# Altium schematic sheet Sheet1.SchDoc: Power Distribution Board
size 431 x 279 mm; ENG_APP_DATE: --/--/--; DSN_APP_DATE: --/--/--; CHK_APP_DATE: --/--/--; Date: 2023-01-01; Author: Vinai Birbal; DocumentNumber: 1; Revision: 1; SheetNumber: 1; SheetTotal: 1
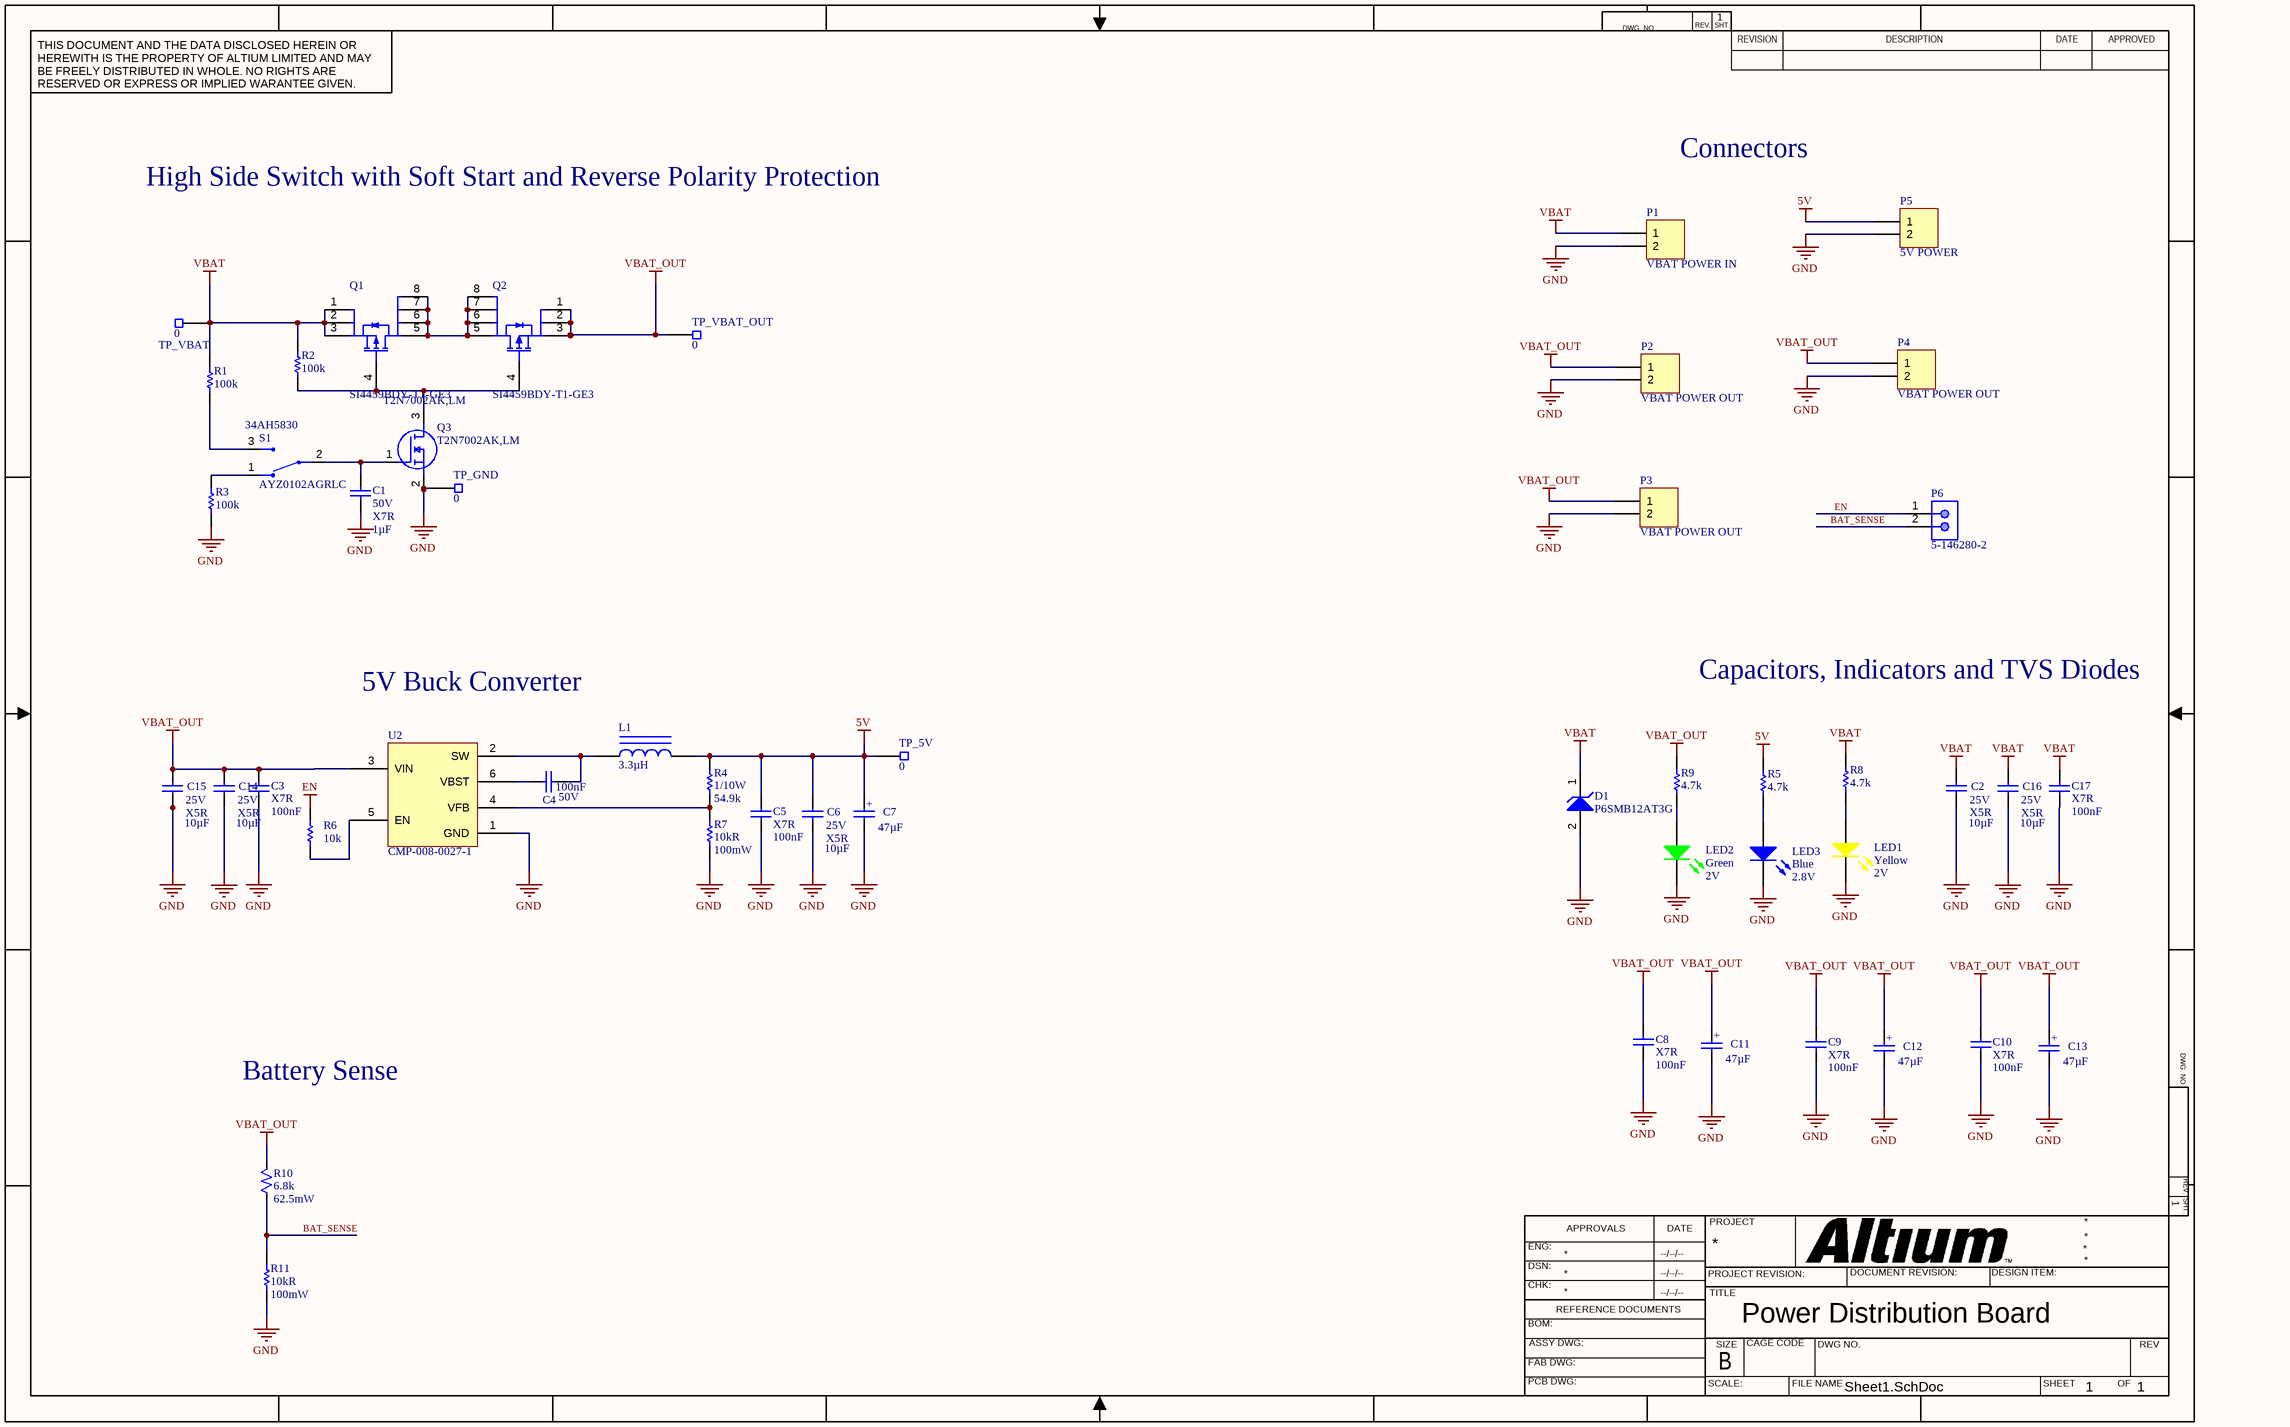
[diagram p0: Sheet1.SchDoc]

## Parts
C1  value 1µF  Voltage: 50V  Temperature Coefficient: X7R  [CAP, 0603]  (hidden comment: CAP CER 1UF 50V 10% X7R 0603)
C2  value 10µF  Voltage: 25V  Temperature Coefficient: X5R  [CAP, 0603]  (hidden comment: CMP-013-0018-1)
C3  value 100nF  Temperature Coefficient: X7R  [FP-GCJ188-0_2-IPC_C]  (hidden comment: CAP_0.1UF_50V_X7R_0603)
C4  value 100nF  Voltage: 50V  [CAP, 0603]  (hidden comment: CMP-013-0022-3)
C5  value 100nF  Temperature Coefficient: X7R  [FP-GCJ188-0_2-IPC_C]  (hidden comment: CAP_0.1UF_50V_X7R_0603)
C6  value 10µF  Voltage: 25V  Temperature Coefficient: X5R  [CAP, 0603]  (hidden comment: CMP-013-0018-1)
C7  value 47µF  [CAP ALUM 6.3MM RADIAL SMD]  (hidden comment: CMP-013-0000-3)
C8  value 100nF  Temperature Coefficient: X7R  [FP-GCJ188-0_2-IPC_C]  (hidden comment: CAP_0.1UF_50V_X7R_0603)
C9  value 100nF  Temperature Coefficient: X7R  [FP-GCJ188-0_2-IPC_C]  (hidden comment: CAP_0.1UF_50V_X7R_0603)
C10  value 100nF  Temperature Coefficient: X7R  [FP-GCJ188-0_2-IPC_C]  (hidden comment: CAP_0.1UF_50V_X7R_0603)
C11  value 47µF  [CAP ALUM 6.3MM RADIAL SMD]  (hidden comment: CMP-013-0000-3)
C12  value 47µF  [CAP ALUM 6.3MM RADIAL SMD]  (hidden comment: CMP-013-0000-3)
C13  value 47µF  [CAP ALUM 6.3MM RADIAL SMD]  (hidden comment: CMP-013-0000-3)
C14  value 10µF  Voltage: 25V  Temperature Coefficient: X5R  [CAP, 0603]  (hidden comment: CMP-013-0018-1)
C15  value 10µF  Voltage: 25V  Temperature Coefficient: X5R  [CAP, 0603]  (hidden comment: CMP-013-0018-1)
C16  value 10µF  Voltage: 25V  Temperature Coefficient: X5R  [CAP, 0603]  (hidden comment: CMP-013-0018-1)
C17  value 100nF  Temperature Coefficient: X7R  [FP-GCJ188-0_2-IPC_C]  (hidden comment: CAP_0.1UF_50V_X7R_0603)
D1  P6SMB12AT3G  [ONSC-SMB-2-403A-03_J_V]
L1  Inductance: 3.3µH  [IND 3.3UH 5.2A 20 MOHM SMD VLP8040]  (hidden comment: CMP-009-0008-2)
LED1  Color: Yellow  Voltage - Forward (Vf) (Typ): 2V  [LED_0603]  (hidden comment: LED YELLOW CLEAR 2.1V 0603)
LED2  Color: Green  Voltage - Forward (Vf) (Typ): 2V  [LED_0603]  (hidden comment: LED GREEN CLEAR 2V 0603)
LED3  Color: Blue  Voltage - Forward (Vf) (Typ): 2.8V  [LED_0603]  (hidden comment: LED BLUE CLEAR 2.8V 0603)
P1  VBAT POWER IN  [B2B-XH]
P2  VBAT POWER OUT  [B2B-XH]
P3  VBAT POWER OUT  [B2B-XH]
P4  VBAT POWER OUT  [B2B-XH]
P5  5V POWER  [B2B-XH]
P6  5-146280-2  [TECO-5-146280-2_V]
Q1  SI4459BDY-T1-GE3  [SI4459BDY-T1-GE3-Footprint-1]
Q2  SI4459BDY-T1-GE3  [SI4459BDY-T1-GE3-Footprint-1]
Q3  T2N7002AK,LM  [TBAT54CLM]
R1  value 100k  [RESC1608X55X25ML10T15]  (hidden comment: Resistor 100k +/-1% 0603 100 mW)
R2  value 100k  [RESC1608X55X25ML10T15]  (hidden comment: Resistor 100k +/-1% 0603 100 mW)
R3  value 100k  [RESC1608X55X25ML10T15]  (hidden comment: Resistor 100k +/-1% 0603 100 mW)
R4  Power (Watts): 1/10W  Resistance (Ohms): 54.9k  [RES, 0603]  (hidden comment: CMP-010-0030-1)
R5  Resistance: 4.7k  [RES, 0603]  (hidden comment: RES 4.7K OHM 1% 1/10W 0603)
R6  Resistance: 10k  [RESC1609X50X30ML8T20]  (hidden comment: RES SMD 10K OHM 1% 1/10W 0603)
R7  Resistance: 10kR  Rated Power Dissipation (P): 100mW  [RESC1609X50X30ML8T20]  (hidden comment: RES SMD 10K OHM 1% 1/10W 0603)
R8  Resistance: 4.7k  [RES, 0603]  (hidden comment: RES 4.7K OHM 1% 1/10W 0603)
R9  Resistance: 4.7k  [RES, 0603]  (hidden comment: RES 4.7K OHM 1% 1/10W 0603)
R10  value 6.8k  Rated Power Dissipation (P): 62.5mW  [RES 0402]  (hidden comment: RES 6.8K OHM 5% 1/16W 0402)
R11  Resistance: 10kR  Rated Power Dissipation (P): 100mW  [RESC1609X50X30ML8T20]  (hidden comment: RES SMD 10K OHM 1% 1/10W 0603)
S1  AYZ0102AGRLC  Supplier Part Number 1: 34AH5830  [SW_AYZ0102AGRLC]
TP_5V  Resistance: 0  [TEST POINT 0603 SMD]  (hidden comment: Test Point 0603 SMD)
TP_GND  Resistance: 0  [TEST POINT 0603 SMD]  (hidden comment: Test Point 0603 SMD)
TP_VBAT  Resistance: 0  [TEST POINT 0603 SMD]  (hidden comment: Test Point 0603 SMD)
TP_VBAT_OUT  Resistance: 0  [TEST POINT 0603 SMD]  (hidden comment: Test Point 0603 SMD)
U2  CMP-008-0027-1  [IC REG BUCK 4.5V TO 17V, 5A]

## Nets
5V: C5.2 C6.1 C7.1 L1.2 P5.1 R4.1 R5.1 TP_5V.1
EN: P6.1 R6.2
GND: C1.2 C2.2 C3.1 C5.1 C6.2 C7.2 C8.1 C9.1 C10.1 C11.2 C12.2 C13.2 C14.2 C15.2 C16.2 C17.1 D1.2(A) LED1.2(K) LED2.2(K) LED3.2(K) P1.2 P2.2 P3.2 P4.2 P5.2 Q3.2(S) R3.1 R7.1 R11.1 TP_GND.1 U2.1(GND)
VBAT: C2.1 C16.1 C17.2 D1.1(K) P1.1 Q1.1(S) Q1.2(S) Q1.3(S) R1.2 R2.2 R8.1
VBAT_OUT: C3.2 C8.2 C9.2 C10.2 C11.1 C12.1 C13.1 C14.1 C15.1 P2.1 P3.1 P4.1 Q2.1(S) Q2.2(S) Q2.3(S) R9.1 R10.2 TP_VBAT_OUT.1 U2.3(VIN)
BAT_SENSE: P6.2 R10.1 R11.2
NetC1_1: C1.1 Q3.1(G) S1.2
NetC4_1: C4.1 U2.6(VBST)
NetC4_2: C4.2 L1.1 U2.2(SW)
NetLED1_1: LED1.1(A) R8.2
NetLED2_1: LED2.1(A) R9.2
NetLED3_1: LED3.1(A) R5.2
NetQ1_4: Q1.4(G) Q2.4(G) Q3.3(D) R2.1
NetQ1_5: Q1.5(D) Q1.6(D) Q1.7(D) Q1.8(D) Q2.5(D) Q2.6(D) Q2.7(D) Q2.8(D)
NetR1_1: R1.1 S1.3
NetR3_2: R3.2 S1.1
NetR4_2: R4.2 R7.2 U2.4(VFB)
NetR6_1: R6.1 U2.5(EN)

Not connected (* = marked no-connect by the designer): TP_VBAT 1

## Notes on the sheet
- Connectors
- High Side Switch with Soft Start and Reverse Polarity Protection
- 5V Buck Converter
- Capacitors, Indicators and TVS Diodes
- Battery Sense
- DWG. NO.
- REV.
- SHT.
- THIS DOCUMENT AND THE DATA DISCLOSED HEREIN OR HEREWITH IS THE PROPERTY OF ALTIUM LIMITED AND MAY BE FREELY DISTRIBUTED IN WHOLE. NO RIGHTS ARE RESERVED OR EXPRESS OR IMPLIED WARANTEE GIVEN.
- REVISION
- DESCRIPTION
- DATE
- APPROVED
- ENG:
- APPROVALS
- PROJECT
- DSN:
- CHK:
- REFERENCE DOCUMENTS
- PROJECT REVISION:
- TITLE
- DOCUMENT REVISION:
- DESIGN ITEM:
- BOM:
- FAB DWG:
- PCB DWG:
- ASSY DWG:
- SCALE:
- SIZE
- B
- CAGE CODE
- FILE NAME
- DWG NO.
- SHEET
- OF
- REV
- (in symbol CMP-013-0000-3) +

## Library data of the parts
C1 = CMP-013-0013-1: 1µF ±10% 50V Ceramic Capacitor X7R 0603 (1608 Metric); Manufacturer Part Number 1: UMK107AB7105KA-T; Manufacturer 1: Taiyo Yuden; ComponentLink1Description: http://www.yuden.co.jp/productdata/catalog/en/mlcc_all_e.pdf; Ratings: -; Part Status: Active; Packaging: Cut Tape (CT); Source: Schematic Diagrams.SchLib; Operating Temperature: -55°C ~ 125°C; Package / Case: 0603 (1608 Metric); Mounting Type: Surface Mount, MLCC; Height - Seated (Max): -; Design Item ID: CAP CER 1UF 50V 10% X7R 0603; Lead Spacing: -; Tolerance: 10%; Lead Style: -; ComponentLink1URL: http://www.yuden.co.jp/productdata/catalog/en/mlcc_all_e.pdf
C2 C6 C14-C16 = CMP-013-0018-1: 10µF ±20% 25V Ceramic Capacitor X5R 0603 (1608 Metric); Manufacturer 1: Murata Electronics North America; Manufacturer Part Number 1: GRM188R61E106MA73D; Packaging: Cut Tape (CT); Part Status: Active; Operating Temperature: -55°C ~ 85°C; Ratings: -; Mounting Type: Surface Mount, MLCC; Package / Case: 0603 (1608 Metric); Size / Dimension: 0.063" L x 0.031" W (1.60mm x 0.80mm); Height - Seated (Max): -; Thickness (Max): 0.031" (0.80mm); Lead Spacing: -; Lead Style: -; ComponentLink1URL: http://www.murata.com/~/media/webrenewal/support/library/catalog/products/capacitor/mlcc/c02e.ashx; ComponentLink1Description: http://www.murata.com/~/media/webrenewal/support/library/catalog/products/capacitor/mlcc/c02e.ashx; Tolerance: 20%; Source: Schematic Diagrams.SchLib; Design Item ID: CAP CER 10uF 25V 20% X5R 0603
C3 C5 C8-C10 C17 = CMP-001-00108-2: CAP CER 0.1UF 50V X7R 0603; Manufacturer 1: Murata Electronics; Manufacturer Part Number 1: GCJ188R71H104KA12D; Tolerance: 10%; Capacitor Type: Ceramic; Pins: 2; Case/Package: 0603; Voltage Rating: 50V; Mounting Technology: Surface Mount; RoHS Compliant: Yes; Max Operating Temperature: 125°C; Min Operating Temperature: -55°C
C4 = CMP-013-0022-3: 0.10µF ±10% 50V Ceramic Capacitor X7R 0603 (1608 Metric); Manufacturer 1: AVX Corporation; Manufacturer Part Number 1: 06035C104KAT2A; Supplier 1: Digi-key; Supplier Part Number 1: 478-5052-1-ND; Packaging: Cut Tape (CT); Part Status: Active; Operating Temperature: -55°C ~ 125°C; Ratings: -; Mounting Type: Surface Mount, MLCC; Package / Case: 0603 (1608 Metric); Size / Dimension: 0.063" L x 0.032" W (1.60mm x 0.81mm); Height - Seated (Max): -; Thickness (Max): 0.035" (0.90mm); Lead Spacing: -; Lead Style: -; ComponentLink1URL: http://datasheets.avx.com/X7RDielectric.pdf; ComponentLink1Description: http://datasheets.avx.com/X7RDielectric.pdf; Tolerance: 10%; Design Item ID: CAP CER 0.1UF 50V 10% X7R 0603; Source: Schematic Diagrams.SchLib
C7 C11-C13 = CMP-013-0000-3: 47µF 35V Aluminum Electrolytic Capacitors Radial, Can - SMD 1000 Hrs @ 85°C; Manufacturer Part Number 1: EEE-1VA470WP; Manufacturer 1: Panasonic; Tolerance: 20%; Ripple Current: 70mA; Life (Hours): 1000Hour; Supplier 1: Digi-Key; Stock 1: 2820; Pricing 1: 1=0.38, 10=0.263, 100=0.1579, 500=0.11846 (USD); Mount: Surface Mount,PCB; Case/Package: Radial; Contact Plating: Tin; Min Operating Temperature: -40°C; Max Operating Temperature: 85°C; Voltage Rating (DC): 35V; Voltage Rating: 35V; Packaging: Tape and Reel; Package Quantity: 1; Ripple Current (AC): 70mA; Termination: SMD/SMT; Diameter: 6.3mm; Length: 5.5mm; Height: 5.4mm; Height - Seated (Max): 0.213inch; Radiation Hardening: No; REACH SVHC: Unknown; Lead Free: Lead Free; ComponentLink1URL: https://datasheet.ciiva.com/2983/aba0000ce2-2983926.pdf; ComponentLink1Description: https://datasheet.ciiva.com/2983/aba0000ce2-2983926.pdf; ComponentLink2URL: https://datasheet.ciiva.com/2983/aba0000ce2-2983927.pdf; ComponentLink2Description: https://datasheet.ciiva.com/2983/aba0000ce2-2983927.pdf; ComponentLink3URL: https://datasheet.ciiva.com/14598/70255710-14598937.pdf; ComponentLink3Description: https://datasheet.ciiva.com/14598/70255710-14598937.pdf; ComponentLink4URL: https://datasheet.ciiva.com/15165/getdatasheetpartid-86239-15165868.pdf; ComponentLink4Description: https://datasheet.ciiva.com/15165/getdatasheetpartid-86239-15165868.pdf; ComponentLink5URL: https://datasheet.ciiva.com/16507/aba0000ce2-16507965.pdf; ComponentLink5Description: https://datasheet.ciiva.com/16507/aba0000ce2-16507965.pdf; ComponentLink6URL: https://datasheet.ciiva.com/30206/11aba0000ce2-30206253.pdf; ComponentLink6Description: https://datasheet.ciiva.com/30206/11aba0000ce2-30206253.pdf; Supplier Part Number 1: PCE3961DKR-ND; Source: Schematic Diagrams.SchLib; Design Item ID: CAP ALUM 47UF 20% 35V SMD
D1 = CMP-1061-00398-1: 600 W Peak Power Zener Transient Voltage Suppressor, Unidirectional, 2-Pin SMB, Pb-Free, Tape and Reel; Manufacturer: On Semiconductor; V(BR) Typ (V): 12; PPK Max (W): 600; IR Max (uA): 5; PackageVersion: Rev. J, 07/2012; PackageReference: SMB-2-403A-03_J; ComponentLink3Description: Package Specification; ComponentLink2Description: Datasheet; Direction: Unidirectional; ComponentLink1Description: Manufacturer URL; ComponentLink2URL: http://www.onsemi.com/pub_link/Collateral/P6SMB6.8AT3-D.PDF; DatasheetVersion: Rev. J; Mounting Technology: Surface Mount; PartNumber: P6SMB12AT3G; ComponentLink3URL: http://www.onsemi.com/pub_link/Collateral/P6SMB6.8AT3-D.PDF; RoHS: Pb-Free; Packing: Tape and Reel; ComponentLink1URL: http://www.onsemi.com/; PackageDescription: 2-Pin Small Molded Package, J-Bend Lead, Body 4.33 x 3.625 mm
L1 = CMP-009-0008-2: 3.3µH Shielded Wirewound Inductor 5.2A 20 mOhm Max Nonstandard; Manufacturer Part Number 1: VLS201612CX-3R3M; Manufacturer 1: TDK Corporation; Material - Core: Ferrite; Tolerance: 20%; Current Rating: 1.37A; Current - Saturation: 1.04A; DC Resistance (DCR): 170 mOhm Max; Frequency - Test: 1MHz; Inductance Tolerance: 30%; Test Frequency: 100kHz; RoHS: RoHS Compliant; Packaging: Cut Tape (CT); Shielding: Shielded; Q @ Freq: -; Frequency - Self Resonant: -; Operating Temperature: -40°C ~ 105°C; Mounting Type: Surface Mount; Package / Case: Nonstandard; Size / Dimension: 0.079" L x 0.063" W (2.00mm x 1.60mm); Height - Seated (Max): 0.047" (1.20mm); Supplier Device Package: 2016; ComponentLink1URL: http://product.tdk.com/en/catalog/datasheets/inductor_commercial_power_vls-cx_en.pdf; ComponentLink1Description: http://product.tdk.com/en/catalog/datasheets/inductor_commercial_power_vls-cx_en.pdf; Supplier 1: Digi-Key; Stock 1: 8114; Pricing 1: 1 = 0.60000, 10 = 0.52700, 100 = 0.37660, 500 = 0.31636 (USD); Mount: Surface Mount; Case/Package: Nonstandard; Core Material: Ferrite; Min Operating Temperature: -40°C; Max Operating Temperature: 105°C; Package Quantity: 1; Saturation Current: 5.2A; Max DC Current: 5.2A; Termination: SMD/SMT; Composition: Wirewound; RMS Current (Irms): 5.2A; Military Standard: Not; Length: 0.315inch; Height: 4mm; Width: 8mm; Depth: 8.7mm; REACH SVHC: No SVHC; Lead Free: Lead Free; ComponentLink2URL: http://www.mouser.com/ds/2/400/nductor_commercial_power_vlp8040_en-952627.pdf; ComponentLink2Description: http://www.mouser.com/ds/2/400/nductor_commercial_power_vlp8040_en-952627.pdf; Supplier Part Number 1: 445-172964-1-ND; Source: Schematic Diagrams.SchLib; Design Item ID: IND 3.3uH 5.2A 20MOHM SMD
LED1 = CMP-011-0011-2: Yellow 590nm LED Indication - Discrete 2V 0603 (1608 Metric); Manufacturer Part Number: 150060YS75000; Manufacturer: Wurth Electronics Inc.; Millicandela Rating: 120mcd; Wavelength - Peak: 595nm; Lens Style/Size: Rectangle with Flat Top, 1.10mm x 0.70mm; Lens Color: Colorless; Viewing Angle: 140°; Current - Test: 20mA; ComponentLink1URL: http://katalog.we-online.de/led/datasheet/150060YS75000.pdf; Part Status: Active; Height (Max): 0.80mm; Source: Schematic Diagrams.SchLib; Mounting Type: Surface Mount; Supplier Device Package: 0603; Pricing 1: 1=0.21, 100=0.1617, 500=0.13964 (CAD); Packaging: Cut Tape (CT); Features: -; Wavelength - Dominant: 590nm; Design Item ID: LED YELLOW CLEAR 2.1V 0603; Case/Package: 0603 (1608 Metric); Lens Transparency: Clear; RoHS: RoHS Compliant; ComponentLink1Description: http://katalog.we-online.de/led/datasheet/150060YS75000.pdf; Stock 1: 10523; Size / Dimension: 1.60mm L x 0.80mm W
LED2 = CMP-011-0009-2: Green 572nm LED Indication - Discrete 2V 0603 (1608 Metric); Manufacturer: Wurth Electronics Inc.; Manufacturer Part Number: 150060VS75000; Lens Color: Colorless; Wavelength - Dominant: 570nm; Lens Style/Size: Rectangle with Flat Top, 1.10mm x 0.70mm; Current - Test: 20mA; Viewing Angle: 140°; Millicandela Rating: 40mcd; Features: -; Stock 1: 9408; Lens Transparency: Clear; Size / Dimension: 1.60mm L x 0.80mm W; Pricing 1: 1=0.21, 100=0.1617, 500=0.13964 (CAD); Mounting Type: Surface Mount; Design Item ID: LED GREEN CLEAR 2V 0603; ComponentLink1URL: http://katalog.we-online.de/led/datasheet/150060VS75000.pdf; Height (Max): 0.80mm; Source: Schematic Diagrams.SchLib; RoHS: RoHS Compliant; Case/Package: 0603 (1608 Metric); Packaging: Cut Tape (CT); Supplier Device Package: 0603; ComponentLink1Description: http://katalog.we-online.de/led/datasheet/150060VS75000.pdf; Part Status: Active; Wavelength - Peak: 572nm
LED3 = CMP-011-0010-2: Blue 470nm LED Indication - Discrete 2.8V 0603 (1608 Metric); Manufacturer 1: Lite-On Inc.; Manufacturer Part Number 1: LTST-C193TBKT-5A; Viewing Angle: 130°; Lens Color: Colorless; Lens Style/Size: Rectangle with Flat Top, 1.15mm x 0.80mm; Millicandela Rating: 15mcd; Wavelength - Peak: 468nm; Current - Test: 5mA; Design Item ID: LED BLUE CLEAR 2.8V 0603; ComponentLink1URL: http://optoelectronics.liteon.com/upload/download/DS22-2004-060/P_100_LTST-C193TBKT-5A.pdf; Lens Transparency: Clear; Wavelength - Dominant: 470nm; Source: Schematic Diagrams.SchLib; Supplier Device Package: Chip LED; Case/Package: 0603 (1608 Metric); Height (Max): 0.45mm; Packaging: Cut Tape (CT); Size / Dimension: 1.60mm L x 0.80mm W; Part Status: Active; Mounting Type: Surface Mount; ComponentLink1Description: http://optoelectronics.liteon.com/upload/download/DS22-2004-060/P_100_LTST-C193TBKT-5A.pdf
P1-P5 = 1x2 Header: 1x2 Pin Header
  P1: ComponentLink1Description: New link; ComponentLink1URL: *; ComponentLink2Description: New link 1; ComponentLink2URL: *
P6 = CMP-2000-07492-1: Male Header, Pitch 2.54 mm, 1 x 2 Position, Height 8.21 mm, Tail Length 3.05 mm, -65 to 105 degC, RoHS, Bulk; Manufacturer: TE Connectivity; Mating Connector Lock: No(Without); Number of Positions: 2; Pitch: 2.54mm; PCB Mounting Orientation: Vertical; Keyed: No; Case\/Package: 100; Mating Post Length: 0.23inch; High Temperature Housing: Yes; Max Current Rating: 5A; PCB Thickness: 0.063inch; PCB Mount Retention: Without; Approvals: CSA; Current Rating: 3A; Radiation Hardening: No; Length: 4.67mm; Contact Mating Length: 0.23inch; Connector Type: Header; Number of Rows: 1; Termination Post Length: 0.12inch; Board Standoff: No(Without); Max Operating Temperature: 105degC; Contact Shape: Square; Selectively Loaded: No(Without); Gasket: No(Without); Number of Contacts: 2; Contact Gender: Male; Mating Alignment: No(Without); Manufacturer URL: http://www.te.com/; Datasheet URL: http://www.te.com/commerce/DocumentDelivery/DDEController?Action=showdoc&DocId=Customer+Drawing%7F146280%7FH1%7Fpdf%7FEnglish%7FENG_CD_146280_H1.pdf%7F5-146280-2; Mount: ThroughHole; Orientation: Straight; Packaging: Carton; Package Reference: 5-146280-2; Package Quantity: 500; Stabilizers: No(Without); Row Spacing: 2.54mm; Contact Material: CopperAlloy; Panel Mount Retention: No(Without); Datasheet Version: Rev. H1, 08/2016; Housing Colour: Black; Colour: Black; Package Description: Male Header, Pitch 2.54 mm, 1 x 2 Position, Height 8.21 mm, Tail Length 3.05 mm; Contact Plating: Matte; Housing Material: Polymer; Contact Protection: No(Without); Min Operating Temperature: -65degC; Mounting Technology: ThroughHole; Flammability Rating: UL94V-0; RoHSCompliant: true; Termination: ThroughHole; Depth: 2.34mm; High Speed Serial Data Connector: No
Q1 Q2 = CMP-031-00041-1: Small Signal Field-Effect Transistor; RoHS Compliant: Yes
Q3 = T2N7002AK,LM: MOSFET (N-Channel); Manufacturer_Name: Toshiba; Datasheet Link: http://toshiba.semicon-storage.com/info/docget.jsp?did=29712&prodName=T2N7002AK; Height: 1.1mm; Manufacturer_Part_Number: T2N7002AK,LM; Mouser Part Number: 757-T2N7002AKLM; Mouser Price/Stock: https://www.mouser.co.uk/ProductDetail/Toshiba/T2N7002AKLM?qs=pzVvXTvk9PzfX4hYglwZ9Q%3D%3D; Arrow Part Number: T2N7002AK,LM; Arrow Price/Stock: https://www.arrow.com/en/products/t2n7002aklm/toshiba?region=nac; Supplier 1: Avnet; Supplier Part Number 1: T2N7002AK,LM
R1-R3 = CMP-009-00023-2: Chip Resistor, 100 KOhm, +/- 1%, 0.1 W, -55 to 155 degC, 0603 (1608 Metric); Voltage Rating: 50V; Power: 100mW; RoHS Compliant: True; Resistance: 100k; Mounting Technology: SM; Tolerance: 1%; Min Operating Temperature: -55°C; Max Operating Temperature: 155°C; Case/Package: 0603; Pins: 2
R4 = CMP-010-0030-1: 54.9k Ohm ±1% 0.1W, 1/10W Chip Resistor 0603 (1608 Metric) Automotive AEC-Q200 Thick Film; Manufacturer: Panasonic Electronic Components; Temperature Coefficient: ±100ppm/°C; RoHS: RoHS Compliant; Stock 1: 74038; Pricing 1: 1=0.16, 10=0.031, 100=0.0127, 1000=0.00567, 2500=0.00492 (CAD); Packaging: Cut Tape (CT); Part Status: Active; Composition: Thick Film; Features: Automotive AEC-Q200; Operating Temperature: -55°C ~ 155°C; Package / Case: 0603 (1608 Metric); Supplier Device Package: 0603; Size / Dimension: 0.063" L x 0.031" W (1.60mm x 0.80mm); Height - Seated (Max): 0.022" (0.55mm); Failure Rate: -; ComponentLink1URL: https://industrial.panasonic.com/cdbs/www-data/pdf/RDA0000/AOA0000C298.pdf; ComponentLink1Description: https://industrial.panasonic.com/cdbs/www-data/pdf/RDA0000/AOA0000C298.pdf; Tolerance: 1%; Design Item ID: RES 54.9K OHM 1% 1/10W 0603; Source: Schematic Diagrams.SchLib; ComponentLink2Description: New link; ComponentLink2URL: *
R5 R8 R9 = CMP-010-0129-1: 4.7k Ohm ±1% 0.1W, 1/10W Chip Resistor 0603 (1608 Metric) Moisture Resistant Thick Film; Manufacturer 1: Yageo; Manufacturer Part Number 1: RC0603FR-074K7L; Description 1: RES SMD 4.7K OHM 1% 1/10W 0603; Temperature Coefficient: ±100ppm/°C; Design Item ID: RES 4.7K OHM 1% 1/10W 0603; Features: Moisture Resistant; Operating Temperature: -55°C ~ 155°C; Stock 1: 3487566; Packaging: Cut Tape (CT); Resistance (Ohms): 4.7k; RoHS: RoHS Compliant; Tolerance: 1%; Source: Schematic Diagrams.SchLib; Composition: Thick Film; Failure Rate: -; Supplier Device Package: 0603; Pricing 1: 1=0.16, 10=0.022, 100=0.0089, 1000=0.00402, 2500=0.00349 (CAD); ComponentLink1URL: http://www.yageo.com/documents/recent/PYu-RC_Group_51_RoHS_L_7.pdf; Part Status: Active; Package / Case: 0603 (1608 Metric); ComponentLink1Description: http://www.yageo.com/documents/recent/PYu-RC_Group_51_RoHS_L_7.pdf
R6 R7 R11 = CMP-009-00200-4: Fixed Resistor, Metal Glaze/thick Film, 0.1W, 10000ohm, 75V, 1% +/-Tol, 100ppm/Cel, Surface Mount, 0603; Manufacturer 1: Vishay; Manufacturer Part Number 1: CRCW060310K0FKEA; Temperature Coefficient: 100ppm/°C; Package Height: 0.45mm; Number of Terminals/Pins: 2; Package Width: 0.85mm; Package Length: 1.55mm; Rated Temperature: 70°C; Reference Standard: AEC-Q200; Supplier 1: Digi-Key; Supplier Part Number 1: 541-10.0KHCT-ND; Packaging: Tape and Reel; Tolerance: 1%; Technology: METAL GLAZE/THICK FILM; Max Operating Temperature: 155°C; Min Operating Temperature: -55°C; Package Shape: Rectangular; Package Style: SMTMeter; Working Voltage: 75V; Resistor Type: FIXED RESISTOR; JESD-609 Code: e3; Termination: Wraparound; Terminal Finish: Nickel; Mount: Surface Mount; Construction: Chip; Size Code: 0603
  R11: ComponentLink1Description: New link; ComponentLink1URL: *
R10 = CMP-009-00248-1: Fixed Resistor, Metal Glaze/thick Film, 0.0625W, 6800ohm, 50V, 5% +/-Tol, 100ppm/Cel, Surface Mount, 0402; Manufacturer Part Number: RC0402JR-076K8L; Manufacturer: Yageo; Rated Temperature: 70°C; Package Width: 0.5mm; Additional Feature: LASER TRIMMABLE; Temperature Coefficient: 100ppm/°C; Package Length: 1mm; Technology: METAL GLAZE/THICK FILM; RoHS Compliant: Yes; ComponentLink2URL: https://datasheet.ciiva.com/2452/pyu-r-int-thick-7-2452782.pdf?src-supplier=Digi-Key; ComponentLink3URL: https://datasheet.ciiva.com/2452/pyu-r-int-thick-7-2452783.pdf?src-supplier=Digi-Key; Category: Chip SMD Resistors; Tolerance: 5%; Design Item ID: RES 6.8K OHM 5% 1/16W 0402; JESD-609 Code: e3; RoHS: Yes; ComponentLink5Description: https://datasheet.ciiva.com/6067/1018594-6067880.pdf?src-supplier=Farnell; Min Operating Temperature: -55°C; Mount: Surface Mount; ComponentLink3Description: https://datasheet.ciiva.com/2452/pyu-r-int-thick-7-2452783.pdf?src-supplier=Digi-Key; Size Code: 0402; Working Voltage: 50V; Source: Local.SchLib; ComponentLink1URL: https://datasheet.ciiva.com:443/pdfs/VipMasterIC/IC/YAGO/YAGO-S-A0008145938/YAGO-S-A0008145938-1.pdf?src-supplier=IHS+Markit; Pins: 2; ComponentLink1Description: https://datasheet.ciiva.com:443/pdfs/VipMasterIC/IC/YAGO/YAGO-S-A0008145938/YAGO-S-A0008145938-1.pdf?src-supplier=IHS+Markit; Package Shape: Rectangular; Terminal Finish: Nickel; ComponentLink2Description: https://datasheet.ciiva.com/2452/pyu-r-int-thick-7-2452782.pdf?src-supplier=Digi-Key; ComponentLink5URL: https://datasheet.ciiva.com/6067/1018594-6067880.pdf?src-supplier=Farnell; Stock 1: 599588; ComponentLink6Description: https://datasheet.ciiva.com/22643/1018594-22643413.pdf?src-supplier=Element14; Package Style: SMTMeter; Termination: Wraparound; Case/Package: 0.35mm; Packaging: Tape and Reel; ComponentLink4URL: https://datasheet.ciiva.com/2452/pyu-r-int-thick-7-2452784.pdf?src-supplier=Digi-Key; Construction: Chip; ComponentLink7Description: https://datasheet.ciiva.com/15189/getdatasheetpartid-326392-15189579.pdf?src-supplier=Verical; ComponentLink6URL: https://datasheet.ciiva.com/22643/1018594-22643413.pdf?src-supplier=Element14; Pricing 1: 1=0.10000, 10=0.01300, 100=0.00540, 1000=0.00244, 2500=0.00212, 5000=0.00175 (USD); ComponentLink4Description: https://datasheet.ciiva.com/2452/pyu-r-int-thick-7-2452784.pdf?src-supplier=Digi-Key; Max Operating Temperature: 155°C; Resistor Type: FIXED RESISTOR; ComponentLink7URL: https://datasheet.ciiva.com/15189/getdatasheetpartid-326392-15189579.pdf?src-supplier=Verical; REACH SVHC: Yes
S1 = AYZ0102AGRLC: Slide Switch SPDT Surface Mount, Right Angle; MF: C&K; Digi-Key_Part_Number: 401-2012-1-ND; Package: None; MP: AYZ0102AGRLC; SnapEDA_Link: https://www.snapeda.com/parts/AYZ0102AGRLC/C%26K/view-part/50616/?ref=snap; Digi-Key_Purchase_URL: https://www.digikey.com/product-detail/en/c-k/AYZ0102AGRLC/401-2012-1-ND/1640121?utm_source=snapeda&utm_medium=aggregator&utm_campaign=symbol; Value: *; Supplier 1: Newark
TP_5V TP_GND TP_VBAT TP_VBAT_OUT = CMP-004-0003-1: Manufacturer Part Number 1: 1625854-3; Manufacturer 1: TE Connectivity; Description 1: Thick Film Resistors - SMD 2000; Case Code (Metric): 1608; Source: Schematic Diagrams.SchLib; Military Standard: Not; Design Item ID: Test Point 0603 SMD; Pricing 1: 1=0.22, 10=0.211, 25=0.18, 50=0.1574, 100=0.1462, 250=0.12932, 500=0.12368, 1000=0.1012 (USD); Length: 1.6mm; ComponentLink2Description: https://datasheet.ciiva.com/8914/eng-ds-1773266-a-8914634.pdf; Case Code (Imperial): 0603; ComponentLink4URL: https://datasheet.ciiva.com/6439/eng-ds-1773266-a-6439164.pdf; Min Operating Temperature: -55°C; ComponentLink1Description: https://datasheet.ciiva.com/30100/1773266-a-30100967.pdf; ComponentLink4Description: https://datasheet.ciiva.com/6439/eng-ds-1773266-a-6439164.pdf; Termination: SMD/SMT; ComponentLink3Description: https://datasheet.ciiva.com/6439/eng-ds-1773266-a-6439163.pdf; Stock 1: 212628; Radiation Hardening: No; Case/Package: 0603; Package Quantity: 2000; ComponentLink3URL: https://datasheet.ciiva.com/6439/eng-ds-1773266-a-6439163.pdf; Height: 1.15mm; ComponentLink1URL: https://datasheet.ciiva.com/30100/1773266-a-30100967.pdf; ComponentLink5URL: https://datasheet.ciiva.com/6439/eng-ds-1773266-a-6439165.pdf; ComponentLink2URL: https://datasheet.ciiva.com/8914/eng-ds-1773266-a-8914634.pdf; Depth: 0.8mm; Width: 0.8mm; Packaging: Tape and Reel; ComponentLink5Description: https://datasheet.ciiva.com/6439/eng-ds-1773266-a-6439165.pdf; Colour: Natural; Max Operating Temperature: 125°C; Mount: Surface Mount
U2 = CMP-008-0027-1: Buck Switching Regulator IC Positive Adjustable 0.6V 1 Output 5A SOT-23-6 Thin, TSOT-23-6; Manufacturer: Texas Instruments; Manufacturer Part Number: TPS565201DDCT; Stock 1: 2226; Pricing 1: 1 = 2.46000, 10 = 2.21100, 100 = 1.77710 (USD); Min Operating Temperature: -40°C; Max Operating Temperature: 125°C; Source: Schematic Diagrams.SchLib; Design Item ID: IC REG BUCK 4.5V TO 17V, 5A, SYNCHRONOUS STE